# Altium schematic sheet FPGA_IO.SchDoc
size A4
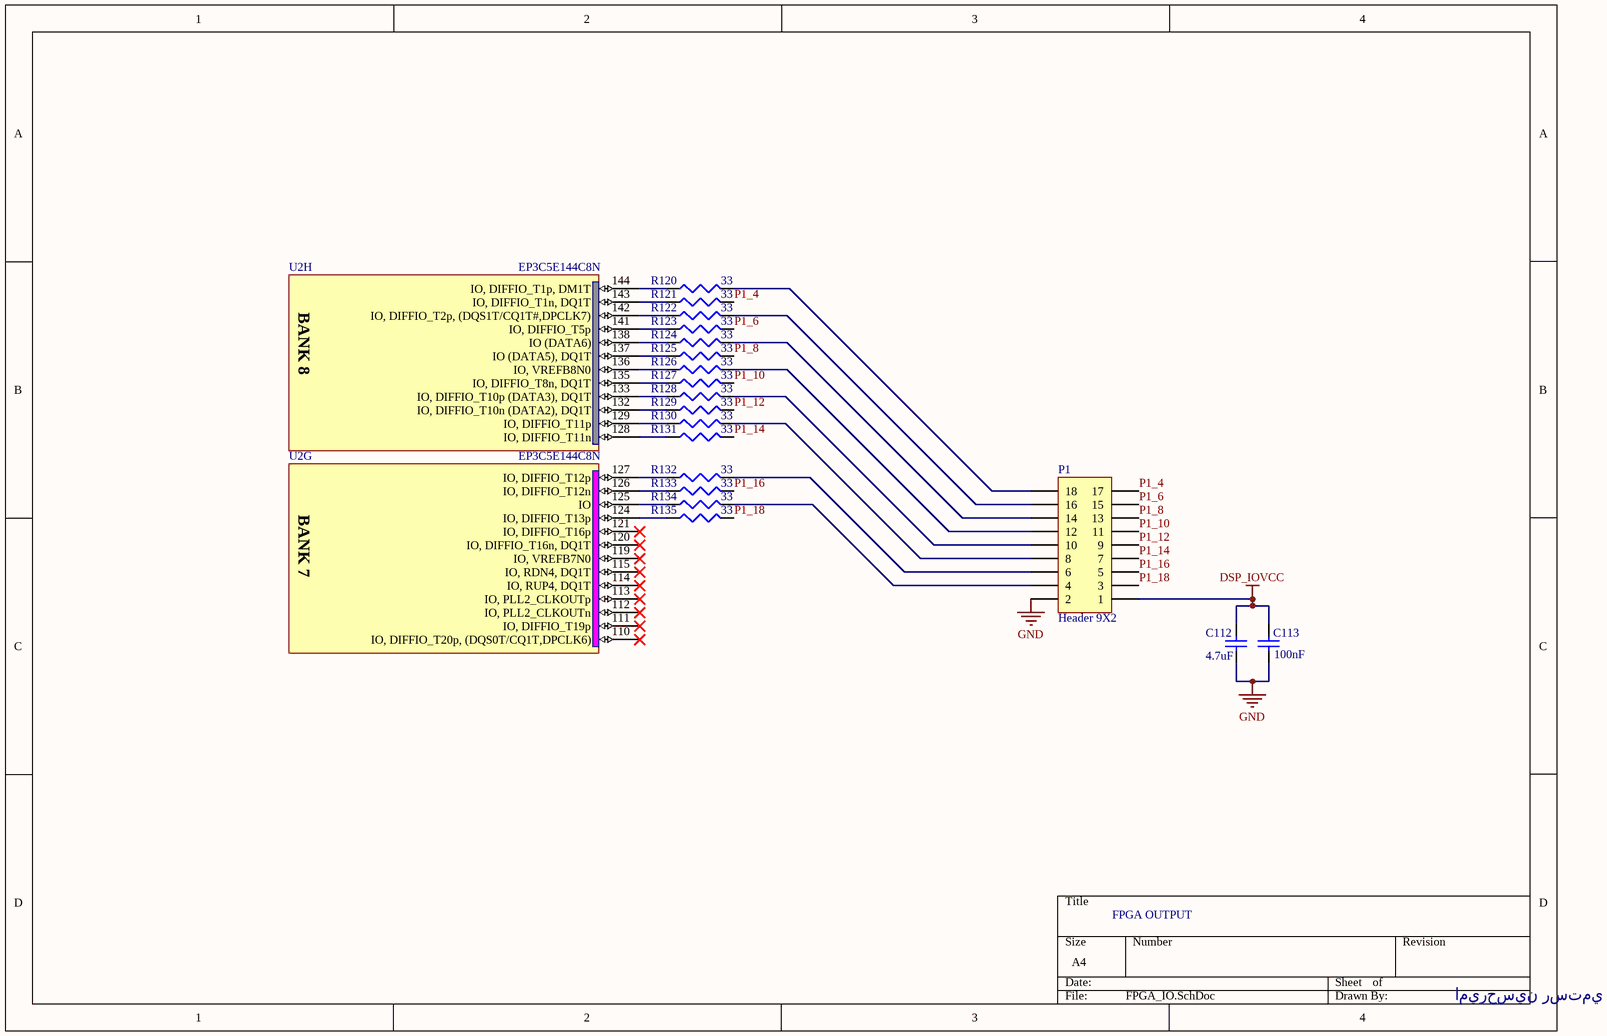
[diagram p0: FPGA_IO.SchDoc]

## Parts
C112  4.7uF  [1608[0603]]
C113  100nF  [1608[0603]]
P1  Header 9X2  [HDR2X9]
R120  33  [J1-0603]
R121  33  [J1-0603]
R122  33  [J1-0603]
R123  33  [J1-0603]
R124  33  [J1-0603]
R125  33  [J1-0603]
R126  33  [J1-0603]
R127  33  [J1-0603]
R128  33  [J1-0603]
R129  33  [J1-0603]
R130  33  [J1-0603]
R131  33  [J1-0603]
R132  33  [J1-0603]
R133  33  [J1-0603]
R134  33  [J1-0603]
R135  33  [J1-0603]
U2  EP3C5E144C8N  [EQFP144_N]  (parts G,H of 13)

## Nets
DSP_IOVCC: C112.2 C113.2 P1.1
GND: C112.1 C113.1 P1.2
P1_4: P1.17 R121.2
P1_6: P1.15 R123.2
P1_8: P1.13 R125.2
P1_10: P1.11 R127.2
P1_12: P1.9 R129.2
P1_14: P1.7 R131.2
P1_16: P1.5 R133.2
P1_18: P1.3 R135.2
NetP1_4: P1.4 R134.2
NetP1_6: P1.6 R132.2
NetP1_8: P1.8 R130.2
NetP1_10: P1.10 R128.2
NetP1_12: P1.12 R126.2
NetP1_14: P1.14 R124.2
NetP1_16: P1.16 R122.2
NetP1_18: P1.18 R120.2
NetR120_1: R120.1 U2.144(IO,_DIFFIO_T1p,_DM1T)
NetR121_1: R121.1 U2.143(IO,_DIFFIO_T1n,_DQ1T)
NetR122_1: R122.1 U2.142(IO,_DIFFIO_T2p,_(DQS1T/CQ1T#,DPCLK7))
NetR123_1: R123.1 U2.141(IO,_DIFFIO_T5p)
NetR124_1: R124.1 U2.138(IO_(DATA6))
NetR125_1: R125.1 U2.137(IO_(DATA5),_DQ1T)
NetR126_1: R126.1 U2.136(IO,_VREFB8N0)
NetR127_1: R127.1 U2.135(IO,_DIFFIO_T8n,_DQ1T)
NetR128_1: R128.1 U2.133(IO,_DIFFIO_T10p_(DATA3),_DQ1T)
NetR129_1: R129.1 U2.132(IO,_DIFFIO_T10n_(DATA2),_DQ1T)
NetR130_1: R130.1 U2.129(IO,_DIFFIO_T11p)
NetR131_1: R131.1 U2.128(IO,_DIFFIO_T11n)
NetR132_1: R132.1 U2.127(IO,_DIFFIO_T12p)
NetR133_1: R133.1 U2.126(IO,_DIFFIO_T12n)
NetR134_1: R134.1 U2.125(IO)
NetR135_1: R135.1 U2.124(IO,_DIFFIO_T13p)

Not connected (* = marked no-connect by the designer): U2 110(IO,_DIFFIO_T20p,_(DQS0T/CQ1T,DPCLK6))* 111(IO,_DIFFIO_T19p)* 112(IO,_PLL2_CLKOUTn)* 113(IO,_PLL2_CLKOUTp)* 114(IO,_RUP4,_DQ1T)* 115(IO,_RDN4,_DQ1T)* 119(IO,_VREFB7N0)* 120(IO,_DIFFIO_T16n,_DQ1T)* 121(IO,_DIFFIO_T16p)*

## Notes on the sheet
- FPGA OUTPUT
- اميرحسين رستمي
- (in symbol EP3C5E144C8N, part G) BANK 7
- (in symbol EP3C5E144C8N, part H) BANK 8

## Library data of the parts
C112 C113 = Cap Semi: Capacitor; Published: 8-Jun-2000; LatestRevisionDate: 17-Jul-2002; LatestRevisionNote: Re-released for DXP Platform.; PackageReference: C1206; Publisher: Altium Limited
  C112: Value: 4.7uF
  C113: Value: 100nF
P1 = Header 9X2: Header, 9-Pin, Dual row; LatestRevisionDate: 17-Jul-2002; LatestRevisionNote: Re-released for DXP Platform.; Publisher: Altium Limited
R120-R135 = Res3: Resistor; Published: 8-Jun-2000; LatestRevisionDate: 04-Mar-2005; LatestRevisionNote: PCB Footprint replaced.; PackageReference: J1-0603; Publisher: Altium Limited; Value: 33
U2 = EP3C5E144C8N: Cyclone III Family FPGA, 94 I/O Pins, 4 PLLs, 144-Pin EQFP, Speed Grade 8, Commercial Grade, Pb-Free; Note: Exposed pad at the bottom of this package must be connected to PCB GND.; Published: 14-Mar-2008; LatestRevisionDate: 27-Jun-2008; LatestRevisionNote: Sch pin for exposed pad added.; DatasheetVersion: ver2.0, May-2008; PackageVersion: ver15.1, May-2008; PackageReference: EQFP144; Publisher: Altium Limited; PackageDescription: 144-Pin Plastic Enhanced Quad Flat Pack (EQFP144) - Wire Bond; Code_JEDEC: MS-026-BFB; ComponentLink1Description: Manufacturer Link; ComponentLink1URL: http://www.altera.com/; ComponentLink2Description: Handbook (7.86MB); ComponentLink2URL: http://www.altera.com/literature/hb/cyc3/cyclone3_handbook.pdf; ComponentLink3Description: Packaging Specification; ComponentLink3URL: http://www.altera.com/literature/ds/dspkg.pdf